# Altium schematic sheet HDMI.SchDoc
size A4
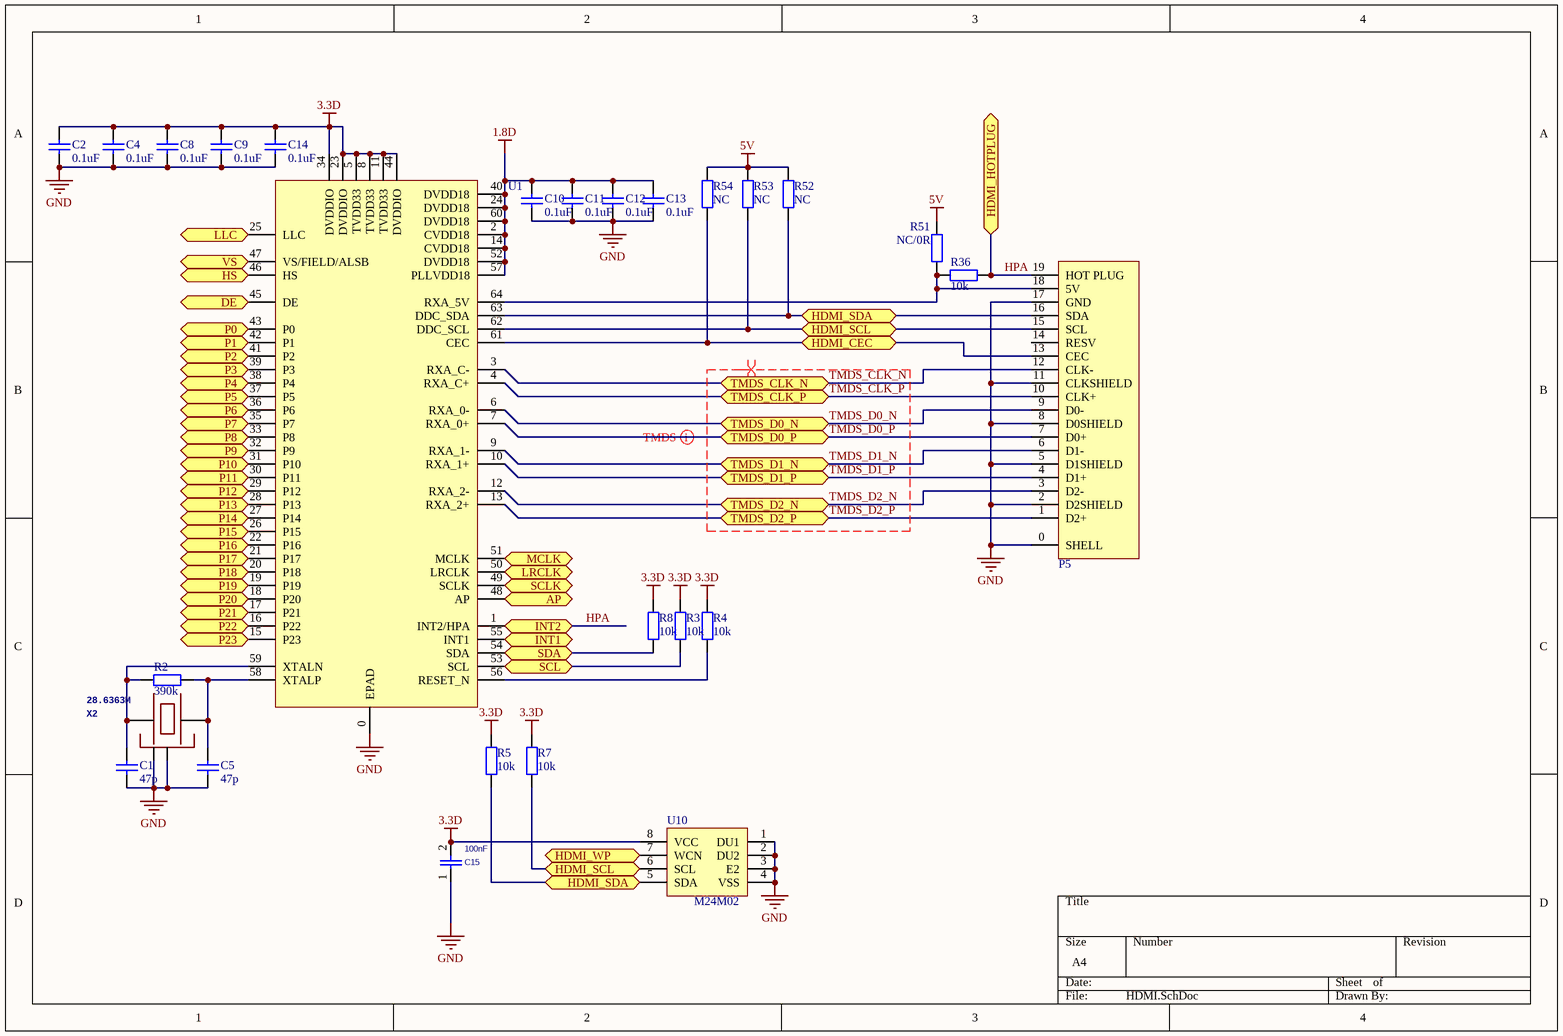
[diagram p0: HDMI.SchDoc]

## Parts
C1  value 47p  [0402]  (hidden comment: Cap)
C2  value 0.1uF  [0402]  (hidden comment: Cap)
C4  value 0.1uF  [0402]  (hidden comment: Cap)
C5  value 47p  [0402]  (hidden comment: Cap)
C8  value 0.1uF  [0402]  (hidden comment: Cap)
C9  value 0.1uF  [0402]  (hidden comment: Cap)
C10  value 0.1uF  [0402]  (hidden comment: Cap)
C11  value 0.1uF  [0402]  (hidden comment: Cap)
C12  value 0.1uF  [0402]  (hidden comment: Cap)
C13  value 0.1uF  [0402]  (hidden comment: Cap)
C14  value 0.1uF  [0402]  (hidden comment: Cap)
C15  100nF  [0402]
P5  HDMI  [HDMI-A]  (value not drawn)
R2  390k  [0402]
R3  10k  [0402]
R4  10k  [0402]
R5  10k  [0402]
R7  10k  [0402]
R8  10k  [0402]
R36  10k  [0402]
R51  NC/0R  [0402]
R52  NC  [0402]
R53  NC  [0402]
R54  NC  [0402]
U1  ADV7611  [ADV7611]  (value not drawn)
U10  M24M02  [SO8]
X2  28.6363M  [OSCILLATOR-3.2X2.5]

## Ports
AP, DE, HDMI_CEC, HDMI_HOTPLUG, HDMI_SCL, HDMI_SDA, HDMI_WP, HS, INT1, INT2, LLC, LRCLK, MCLK, P0, P1, P2, P3, P4, P5, P6, P7, P8, P9, P10, P11, P12, P13, P14, P15, P16, P17, P18, P19, P20, P21, P22, P23, SCL, SCLK, SDA, TMDS_CLK_N, TMDS_CLK_P, TMDS_D0_N, TMDS_D0_P, TMDS_D1_N, TMDS_D1_P, TMDS_D2_N, TMDS_D2_P, VS

## Nets
1.8D: C10.2 C11.2 C12.2 C13.2 U1.2(CVDD18) U1.14(CVDD18) U1.24(DVDD18) U1.40(DVDD18) U1.52(DVDD18) U1.57(PLLVDD18) U1.60(DVDD18)
3.3D: C2.2 C4.2 C8.2 C9.2 C14.2 C15.2 R3.1 R4.1 R5.1 R7.1 R8.1 U1.5(TVDD33) U1.8(TVDD33) U1.11(TVDD33) U1.23(DVDDIO) U1.34(DVDDIO) U1.44(DVDDIO) U10.8(VCC)
5V: R51.2 R52.1 R53.1 R54.1
GND: C1.1 C2.1 C4.1 C5.1 C8.1 C9.1 C10.1 C11.1 C12.1 C13.1 C14.1 C15.1 P5.0(SHELL) P5.2(D2SHIELD) P5.5(D1SHIELD) P5.8(D0SHIELD) P5.11(CLKSHIELD) P5.17(GND) U1.0(EPAD) U10.1(DU1) U10.2(DU2) U10.3(E2) U10.4(VSS) X2.2(NC_2) X2.4(NC_4)
AP: U1.48(AP) ; port AP
DE: U1.45(DE) ; port DE
HDMI_CEC: P5.13(CEC) R54.2 U1.61(CEC) ; port HDMI_CEC
HDMI_SCL: P5.15(SCL) R7.2 R53.2 U1.62(DDC_SCL) U10.6(SCL) ; port HDMI_SCL
HDMI_SDA: P5.16(SDA) R5.2 R52.2 U1.63(DDC_SDA) U10.5(SDA) ; port HDMI_SDA
HDMI_WP: U10.7(WCN) ; port HDMI_WP
HPA: P5.19(HOT_PLUG) R36.1 U1.1(INT2/HPA) ; port HDMI_HOTPLUG, port INT2
HS: U1.46(HS) ; port HS
INT1: U1.55(INT1) ; port INT1
LLC: U1.25(LLC) ; port LLC
LRCLK: U1.50(LRCLK) ; port LRCLK
MCLK: U1.51(MCLK) ; port MCLK
P0: U1.43(P0) ; port P0
P1: U1.42(P1) ; port P1
P2: U1.41(P2) ; port P2
P3: U1.39(P3) ; port P3
P4: U1.38(P4) ; port P4
P5: U1.37(P5) ; port P5
P6: U1.36(P6) ; port P6
P7: U1.35(P7) ; port P7
P8: U1.33(P8) ; port P8
P9: U1.32(P9) ; port P9
P10: U1.31(P10) ; port P10
P11: U1.30(P11) ; port P11
P12: U1.29(P12) ; port P12
P13: U1.28(P13) ; port P13
P14: U1.27(P14) ; port P14
P15: U1.26(P15) ; port P15
P16: U1.22(P16) ; port P16
P17: U1.21(P17) ; port P17
P18: U1.20(P18) ; port P18
P19: U1.19(P19) ; port P19
P20: U1.18(P20) ; port P20
P21: U1.17(P21) ; port P21
P22: U1.16(P22) ; port P22
P23: U1.15(P23) ; port P23
SCL: R3.2 U1.53(SCL) ; port SCL
SCLK: U1.49(SCLK) ; port SCLK
SDA: R8.2 U1.54(SDA) ; port SDA
TMDS_CLK_N: P5.12(CLK-) U1.3(RXA_C-) ; port TMDS_CLK_N
TMDS_CLK_P: P5.10(CLK+) U1.4(RXA_C+) ; port TMDS_CLK_P
TMDS_D0_N: P5.9(D0-) U1.6(RXA_0-) ; port TMDS_D0_N
TMDS_D0_P: P5.7(D0+) U1.7(RXA_0+) ; port TMDS_D0_P
TMDS_D1_N: P5.6(D1-) U1.9(RXA_1-) ; port TMDS_D1_N
TMDS_D1_P: P5.4(D1+) U1.10(RXA_1+) ; port TMDS_D1_P
TMDS_D2_N: P5.3(D2-) U1.12(RXA_2-) ; port TMDS_D2_N
TMDS_D2_P: P5.1(D2+) U1.13(RXA_2+) ; port TMDS_D2_P
VS: U1.47(VS/FIELD/ALSB) ; port VS
NetC1_2: C1.2 R2.1 U1.59(XTALN) X2.1
NetC5_2: C5.2 R2.2 U1.58(XTALP) X2.3
NetP5_18: P5.18(5V) R36.2 R51.1 U1.64(RXA_5V)
NetR4_2: R4.2 U1.56(RESET_N)

Not connected (* = marked no-connect by the designer): P5 14(RESV)

## Layout directives
differential pair: TMDS_CLK_N, TMDS_CLK_P, TMDS_D0_N, TMDS_D0_P, TMDS_D1_N, TMDS_D1_P, TMDS_D2_N, TMDS_D2_P
net class TMDS: TMDS_D0_P

## Library data of the parts
C1 C2 C4 C5 C8-C14 = Cap: Capacitor; Published: 8-Jun-2000; LatestRevisionDate: 17-Jul-2002; LatestRevisionNote: Re-released for DXP Platform.; PackageReference: RAD-0.3; Publisher: Altium Limited; PackageDescription: Radial Cap, Thru-Hole; 2 Leads; 0.3 in Pin Spacing
C15 = CAP/0402: 1st Part Field: 0402
R2-R5 R7 R8 R36 R51-R54 = Res2: Resistor; Value: 0Ohm; Published: 8-Jun-2000; LatestRevisionDate: 17-Jul-2002; LatestRevisionNote: Re-released for DXP Platform.; PackageReference: AXIAL-0.4; Publisher: Altium Limited; PackageDescription: Axial Device, Thru-Hole; 2 Leads; 0.4 in Pin Spacing
X2 = OSCILLATOR-3.2X2.5: Crystal Oscillator in 3.2x2.5 SMD